# Altium schematic sheet Vaccum-Tube Power Amplifier.schdoc: Valve Power Amplifier
size A4; Organization: Altium Limited; Address1: L3, 12a Rodborough Rd; Address2: Frenchs Forest; Address3: NSW; Address4: Australia 2086; DocumentNumber: 1; SheetNumber: 1; SheetTotal: 1
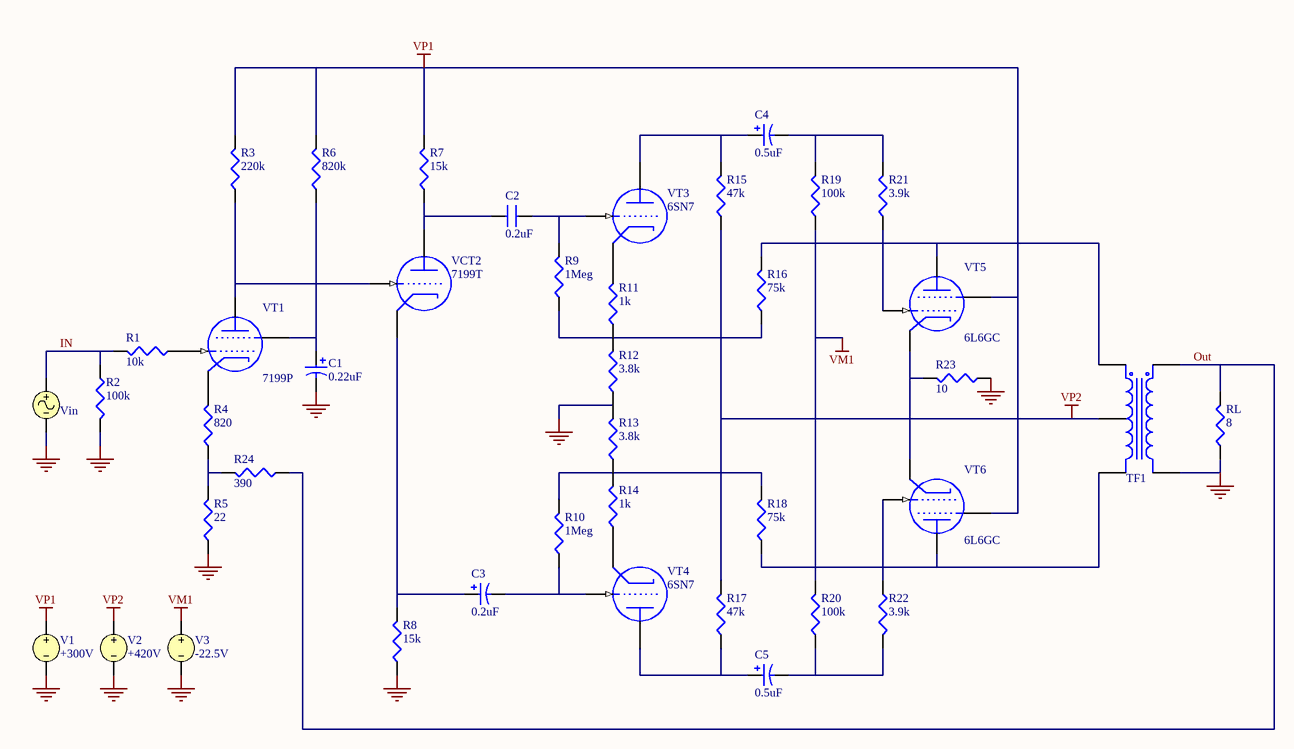
[diagram p0: Vaccum-Tube Power Amplifier.schdoc]

## Parts
C1  0.22uF
C2  0.2uF
C3  0.2uF
C4  0.5uF
C5  0.5uF
R1  10k
R2  100k
R3  220k
R4  820
R5  22
R6  820k
R7  15k
R8  15k
R9  1Meg
R10  1Meg
R11  1k
R12  3.8k
R13  3.8k
R14  1k
R15  47k
R16  75k
R17  47k
R18  75k
R19  100k
R20  100k
R21  3.9k
R22  3.9k
R23  10
R24  390
RL  8
TF1  TRANSFORMERCT  (value not drawn)
V1  +300V
V2  +420V
V3  -22.5V
VCT2  7199T
Vin  VSIN  (value not drawn)
VT1  7199P
VT3  6SN7
VT4  6SN7
VT5  6L6GC
VT6  6L6GC

## Nets
GND: C1.2 R2.1(TOP) R5.2(BOT) R8.2(BOT) R12.2(BOT) R13.1(TOP) R23.2(BOT) RL.2(BOT) TF1.2(Pri-) V1.2 V2.2 V3.2 Vin.2
VM1: R19.2(BOT) R20.1(TOP) V3.1
VP1: R3.1(TOP) R6.1(TOP) R7.1(TOP) V1.1 VT5.2(SCRG) VT6.2(SCRG)
VP2: R15.2(BOT) R17.1(TOP) TF1.4(SecCT) V2.1
IN: R1.1(TOP) R2.2(BOT) Vin.1
Out: R24.2(BOT) RL.1(TOP) TF1.1(Pri+)
NetC1_1: C1.1 R6.2(BOT) VT1.2(SCRG)
NetC2_1: C2.1 R7.2(BOT) VCT2.1(P)
NetC2_2: C2.2 R9.1(TOP) VT3.2(G)
NetC3_1: C3.1 R8.1(TOP) VCT2.3(K)
NetC3_2: C3.2 R10.2(BOT) VT4.2(G)
NetC4_1: C4.1 R15.1(TOP) VT3.1(P)
NetC4_2: C4.2 R19.1(TOP) R21.1(TOP)
NetC5_1: C5.1 R17.2(BOT) VT4.1(P)
NetC5_2: C5.2 R20.2(BOT) R22.1(TOP)
NetR1_2: R1.2(BOT) VT1.3(CTLG)
NetR3_2: R3.2(BOT) VCT2.2(G) VT1.1(P)
NetR4_1: R4.1(TOP) VT1.4(K)
NetR4_2: R4.2(BOT) R5.1(TOP) R24.1(TOP)
NetR9_2: R9.2(BOT) R11.2(BOT) R12.1(TOP) R16.2(BOT)
NetR10_1: R10.1(TOP) R13.2(BOT) R14.1(TOP) R18.1(TOP)
NetR11_1: R11.1(TOP) VT3.3(K)
NetR14_2: R14.2(BOT) VT4.3(K)
NetR16_1: R16.1(TOP) TF1.3(Sec+) VT5.1(P)
NetR18_2: R18.2(BOT) TF1.5(Sec-) VT6.1(P)
NetR21_2: R21.2(BOT) VT5.3(CTLG)
NetR22_2: R22.2(BOT) VT6.3(CTLG)
NetR23_1: R23.1(TOP) VT5.4(K) VT6.4(K)

## Notes on the sheet
- Title
- Size:
- Date:
- A4
- Number:
- Time:
- Revision:
- Sheet
- of
- File:

## Library data of the parts
C1 C3-C5 = CAP2: Bi-Polar Capacitor
  C1: Value: 0.22uF
  C3: Value: 0.2uF
  C4 C5: Value: 0.5uF
C2 = CAP: Capacitor; Value: 0.2uF
R1-R24 RL = RES: Resistor
  R1: Value: 10k
  R2 R19 R20: Value: 100k
  R3: Value: 220k
  R4: Value: 820
  R5: Value: 22
  R6: Value: 820k
  R7 R8: Value: 15k
  R9 R10: Value: 1Meg
  R11 R14: Value: 1k
  R12 R13: Value: 3.8k
  R15 R17: Value: 47k
  R16 R18: Value: 75k
  R21 R22: Value: 3.9k
  R23: Value: 10
  R24: Value: 390
  RL: Value: 8
TF1 = TRANSFORMERCT: CT Transformer (Coupled Inductor Model)
V1-V3 = VSRC: Voltage Source
  V1: Value: +300V
  V2: Value: +420V
  V3: Value: -22.5V
VCT2 = 7199T: Triode
Vin = VSIN: Sinusoidal Voltage Source
VT1 = 7199P: Tetrode
VT3 VT4 = 6SN7: Triode
VT5 VT6 = 6L6GC: Tetrode